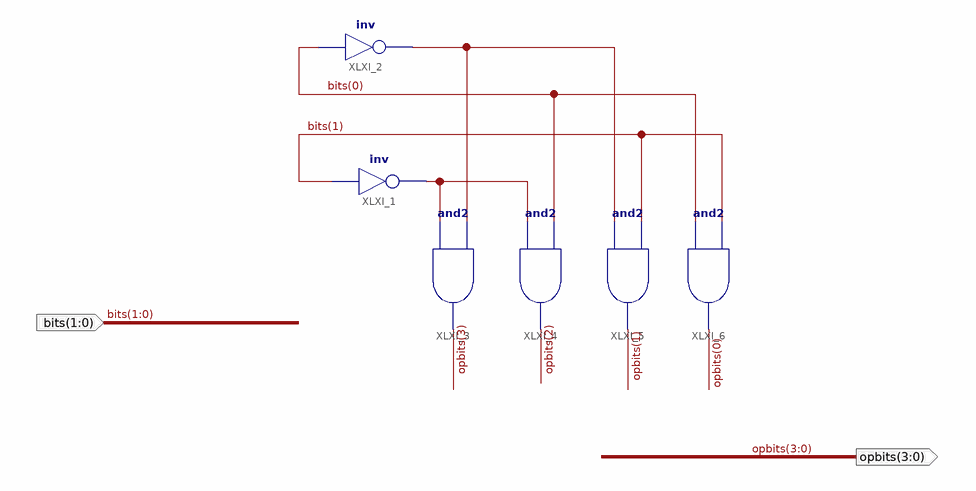
[diagram p0: schematic sheet 1]
// Xilinx ISE schematic decoder1_4.sch (spartan6) as structural Verilog: 6 symbols, 2 ports
module decoder1_4 (
  input  [1:0] bits,
  output [3:0] opbits
);

  wire XLXN_8, XLXN_9;

  not XLXI_1 (XLXN_9, bits[1]);
  not XLXI_2 (XLXN_8, bits[0]);
  and XLXI_3 (opbits[3], XLXN_9, XLXN_8);
  and XLXI_4 (opbits[2], XLXN_9, bits[0]);
  and XLXI_5 (opbits[1], XLXN_8, bits[1]);
  and XLXI_6 (opbits[0], bits[0], bits[1]);
endmodule
